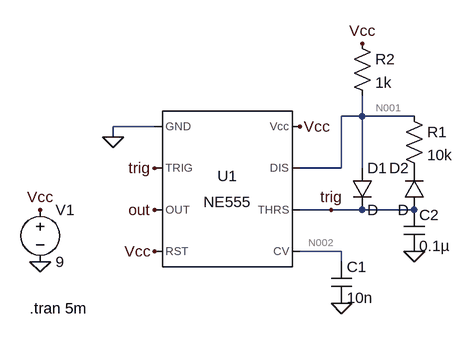
[diagram p0: schematic 555TimerSimulation.asc]
555TimerSimulation.asc, the LTspice schematic file:
Version 4.1
SHEET 1 880 680
WIRE 560 -80 560 -112
WIRE 560 -80 528 -80
WIRE 640 -80 560 -80
WIRE 240 -64 176 -64
WIRE 176 -48 176 -64
WIRE 528 0 528 -80
WIRE 528 0 464 0
WIRE 560 0 560 -80
WIRE 512 64 464 64
WIRE 560 64 512 64
WIRE 640 64 560 64
WIRE 528 128 464 128
WIRE 528 144 528 128
FLAG 528 208 0
FLAG 64 144 0
FLAG 176 -48 0
FLAG 240 0 trig
FLAG 640 128 0
FLAG 64 64 Vcc
FLAG 560 -192 Vcc
FLAG 240 64 out
FLAG 512 64 trig
FLAG 464 -64 Vcc
FLAG 240 128 Vcc
SYMBOL Misc\\NE555 352 32 R0
SYMATTR InstName U1
SYMBOL cap 512 144 R0
SYMATTR InstName C1
SYMATTR Value 10n
SYMBOL voltage 64 48 R0
WINDOW 123 0 0 Left 0
WINDOW 39 0 0 Left 0
SYMATTR InstName V1
SYMATTR Value 9
SYMBOL diode 544 0 R0
SYMATTR InstName D1
SYMBOL diode 656 64 R180
WINDOW 0 24 64 Left 2
WINDOW 3 24 0 Left 2
SYMATTR InstName D2
SYMBOL res 624 -96 R0
SYMATTR InstName R1
SYMATTR Value 10k
SYMBOL res 544 -208 R0
SYMATTR InstName R2
SYMATTR Value 1k
SYMBOL cap 624 64 R0
SYMATTR InstName C2
SYMATTR Value 0.1µ
TEXT 48 216 Left 2 !.tran 5m

The netlist it stands for:
* 555TimerSimulation.asc
X§U1 0 trig out Vcc N002 trig N001 Vcc NE555  ; pins GND TRIG OUT RST CV THRS DIS Vcc
C1 N002 0 10n
V1 Vcc 0 9
D1 N001 trig D
D2 trig P001 D
R1 N001 P001 10k
R2 Vcc N001 1k
C2 trig 0 0.1µ
.model D D
.lib standard.dio
.tran 5m
.lib NE555.sub
.backanno
.end

* Results of the author's LTspice run, read from the files saved beside the schematic
* Operating Point, zero values left out:
*   V(n001) = 9 V
*   V(n002) = 6 V
*   V(out) = 9 V
*   V(p001) = 9 V
*   V(trig) = 8.629 V
*   V(vcc) = 9 V
*   I(D1) = 17.26 nA
*   I(R2) = 29.27 nA
*   I(V1) = -2.908 mA
*   Ix(u1:1) = -2.908 mA
*   Ix(u1:2) = 8.629 nA
*   Ix(u1:4) = 49.33 µA
*   Ix(u1:6) = 8.629 nA
*   Ix(u1:7) = 12.01 nA
*   Ix(u1:8) = 2.859 mA
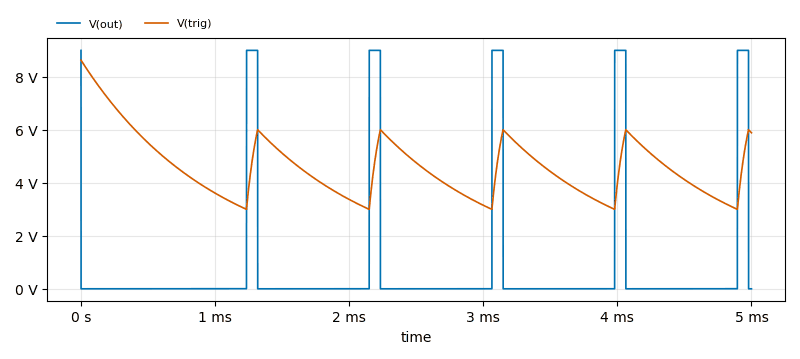
[diagram p1: Transient Analysis of 555TimerSimulation.asc, plotted from the saved traces]
* Transient Analysis, 1 run:
*   V(out): min 54 µV, max 9 V, average 749.8 mV, rms 2.598 V, last 54 µV
*   V(trig): min 2.999 V, max 8.629 V, average 4.574 V, rms 4.722 V, last 5.889 V